# Altium schematic sheet PCB1.SchDoc
size A4
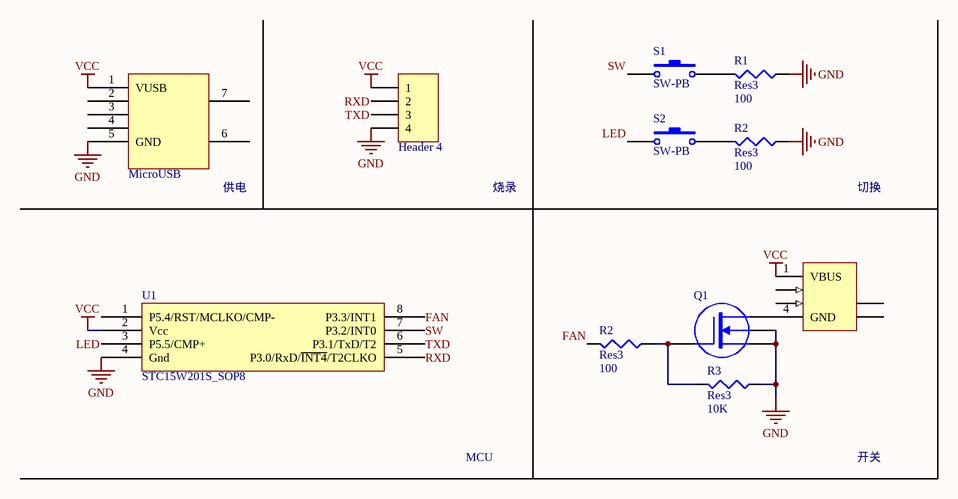
[diagram p0: PCB1.SchDoc]

## Parts
(Parts that share a designator on the sheet are numbered #1, #2 ... from top to bottom, then left to right.)
*  MicroUSB  [microusb]
J1  440068-1  [440068]  (value not drawn)
P1  Header 4  [HDR1X4]
Q1  MOSFET-N4  [SOT-343_N]  (value not drawn)
R1  Res3  value 100  [J1-0603]
R2#1  Res3  value 100  [J1-0603]
R2#2  Res3  value 100  [J1-0603]
R3  Res3  value 10K  [J1-0603]
S1  SW-PB  [SPST-2]
S2  SW-PB  [SPST-2]
U1  STC15W201S_SOP8  [SOP8]

## Nets
GND: *.5(GND) P1.4 Q1.3(U) Q1.4(S) R1.1 R2#1.1 R3.1 U1.4(Gnd)
VCC: *.1(VUSB) J1.1(VBUS) P1.1 U1.2(Vcc)
FAN: R2#2.2 U1.8(P3.3/INT1)
LED: S2.1 U1.3(P5.5/CMP+)
RXD: P1.2 U1.5(P3.0/RxD/~{INT4}/T2CLKO)
SW: S1.1 U1.7(P3.2/INT0)
TXD: P1.3 U1.6(P3.1/TxD/T2)
NetJ1_4: J1.4(GND) Q1.2(D)
NetQ1_1: Q1.1(G) R2#2.1 R3.2
NetR1_2: R1.2 S1.2
NetR2#1_2: R2#1.2 S2.2

Not connected (* = marked no-connect by the designer): * 2(D-) 3(D+) 4(ID) 6(NOP) 7(NOP); J1 2(D-) 3(D+) 5(SHLD) 6(SHLD); U1 1(P5.4/RST/MCLKO/CMP-)

## Notes on the sheet
- (near *) 供电
- 烧录
- 切换
- MCU
- 开关

## Library data of the parts
J1 = 440068-1: USB 1.1, Right Angle, Thru-Hole, Reverse Type, Receptacle, 4 Position, Black; ContactMaterial: Copper Alloy; ContactPlating: Gold Flash; TerminationLength: 2.40mm [0.094in.]; PCB_Layout: Complies with manufacturer's recommendation.; DrillSize: Corresponds to nominal value.; PanelGround: Without; Published: 15-Jul-2004; DatasheetDocument: 18-Mar-2004; PackageDocument: 18-Mar-2004; PackageReference: 440068; Publisher: Altium Limited; HousingMaterial: Glass-Filled Thermoplastic; ComponentLink1Description: Manufacturer Link; ComponentLink1URL: http://www.tycoelectronics.com/; ComponentLink2Description: Packaging Specification; ComponentLink2URL: http://ecommas.tycoelectronics.com/commerce/DocumentDelivery/DDEController?Action=showdoc&DocId=Customer+Drawing%7F440068%7FD%7Ftif%7FEnglish%7FC_440068_D.tif
P1 = Header 4: Header, 4-Pin; LatestRevisionDate: 17-Jul-2002; LatestRevisionNote: Re-released for DXP Platform.; Publisher: Altium Limited
Q1 = MOSFET-N4: N-Channel MOSFET, Externally Terminated Substrate; Published: 24-Mar-1999; LatestRevisionDate: 29-May-2009; LatestRevisionNote: IPC-7351 Footprint Added.; PackageVersion: Sep-2000; PackageReference: SOT-343; Publisher: Altium Limited; PackageDescription: 4-Pin SOT-343 Package 1.3 mm Pitch, 2.1 mm Lead Span
R1 R2#1 R2#2 R3 = Res3: Resistor; Published: 8-Jun-2000; LatestRevisionDate: 29-May-2009; LatestRevisionNote: IPC-7351 Footprint Added.; PackageReference: J1-0603; Publisher: Altium Limited; PackageDescription: Chip Resistor
S1 S2 = SW-PB: Switch; Published: 24-Mar-1999; LatestRevisionDate: 17-Jul-2002; LatestRevisionNote: Re-released for DXP Platform.; PackageReference: SPST-2; Publisher: Altium Limited; PackageDescription: Switch; 2 Leads